# EAGLE design MCB-Pine64-IoT-Stamp-v1.0.0 (EAGLE 7.7.0)

## Sheet 1 of 2
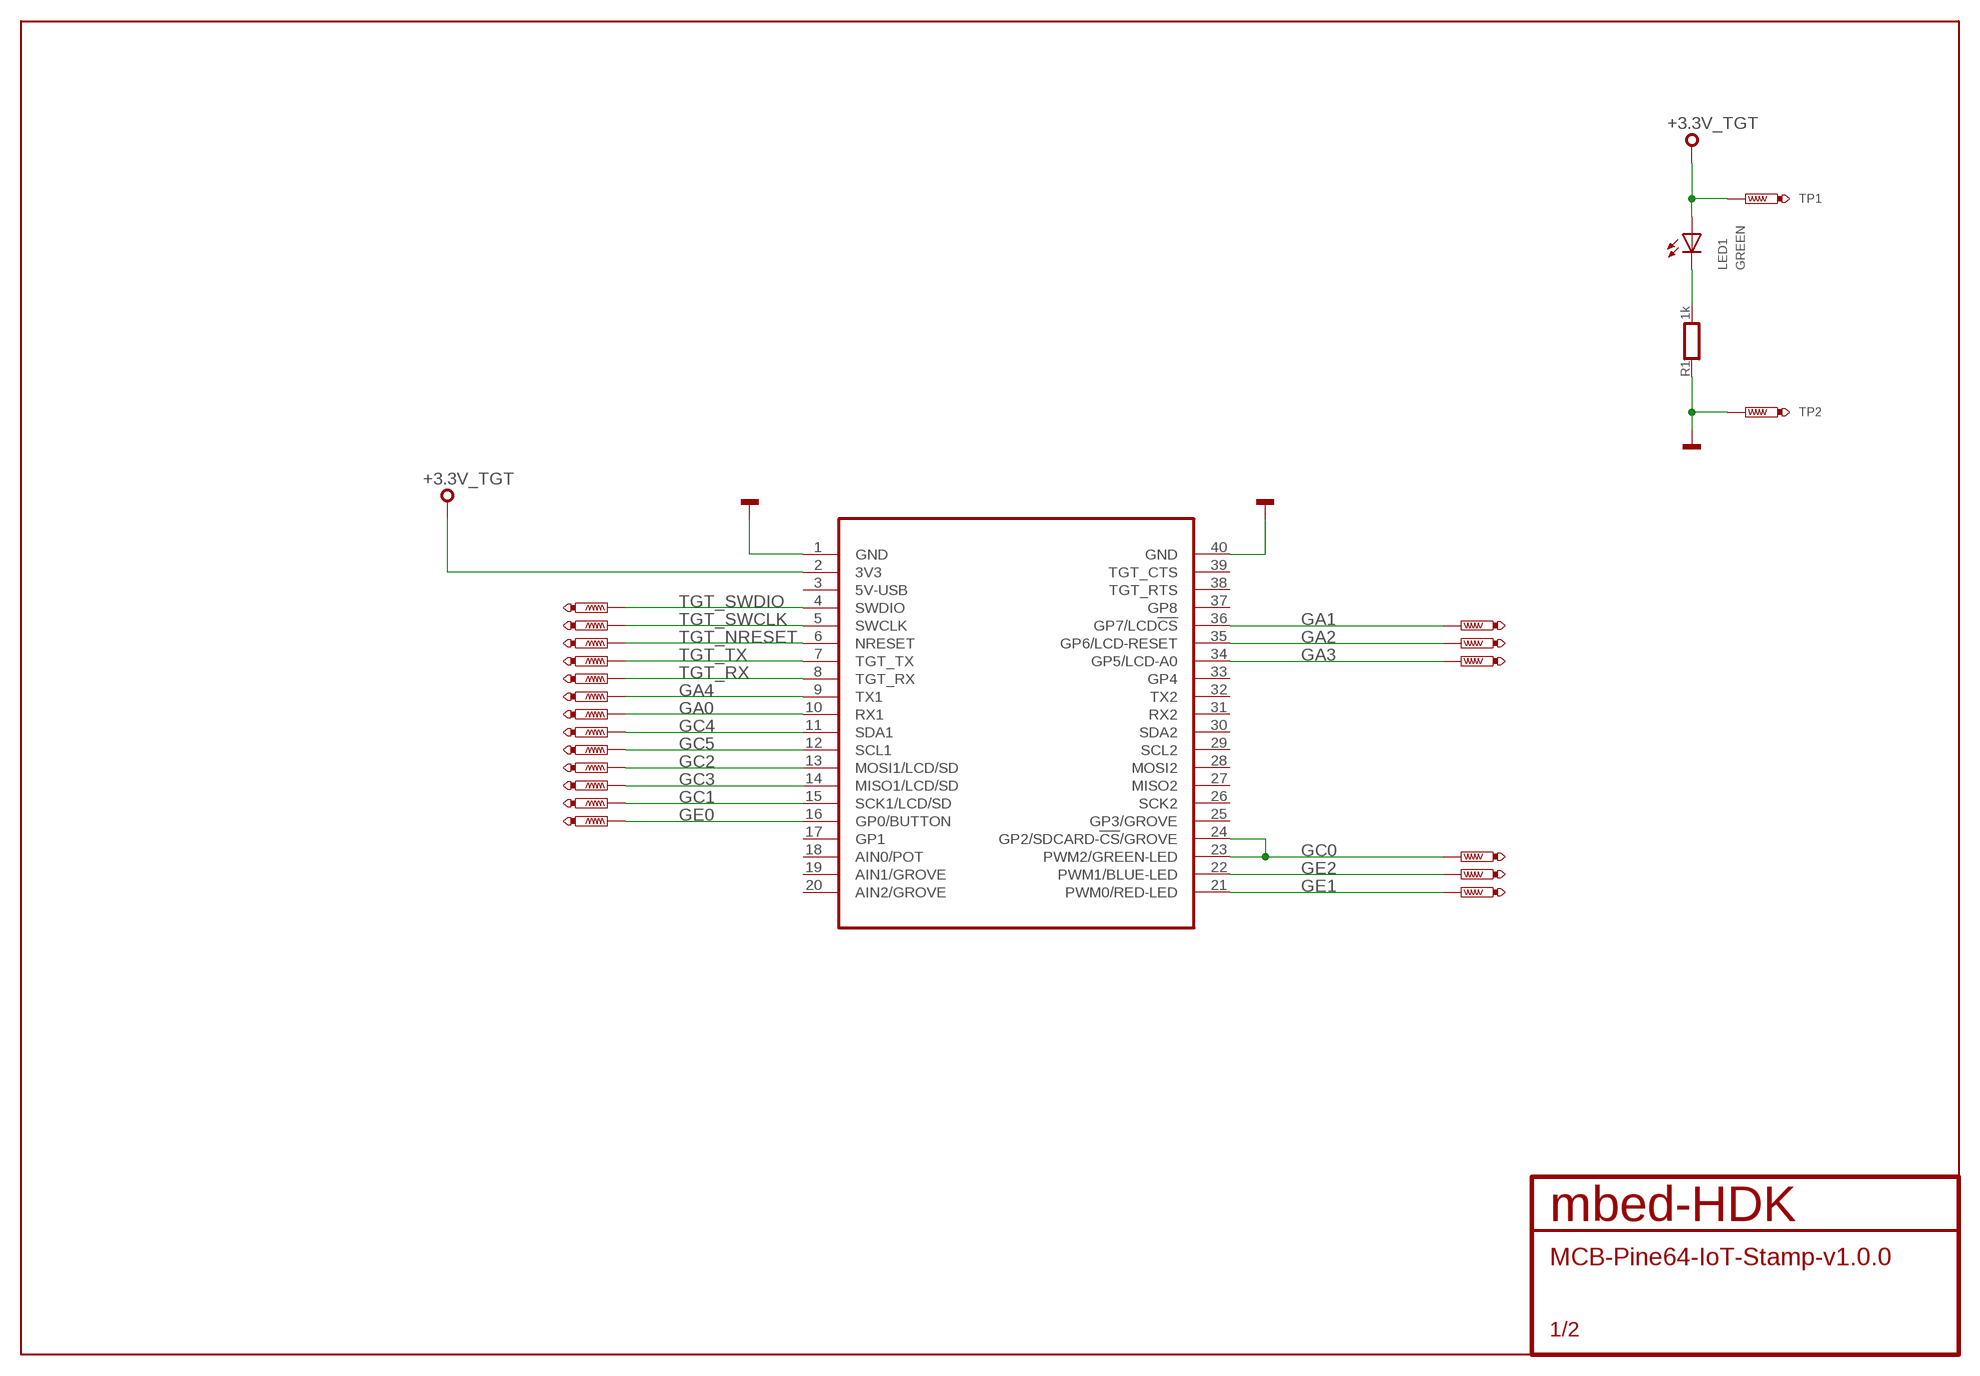
[diagram p0: schematic, sheet 1]

### Parts
LED1  GREEN  SMD_LED0603  [CHIPLED_0603]
MOD1  MODULE_DAUGHTER  [MODULE_DAUGHTER]
R1  1k  RESISTOR0603  [0603]
TP1  TEST-POINT-50R-PTH  [TP50-PTH]
TP2  TEST-POINT-50R-PTH  [TP50-PTH]
TP3  PTR1TP07R  [TP07R]
TP4  PTR1TP07R  [TP07R]
TP7  PTR1TP07R  [TP07R]
TP8  PTR1TP07R  [TP07R]
TP9  PTR1TP07R  [TP07R]
TP13  PTR1TP07R  [TP07R]
TP14  PTR1TP07R  [TP07R]
TP15  PTR1TP07R  [TP07R]
TP17  PTR1TP07R  [TP07R]
TP19  PTR1TP07R  [TP07R]
TP20  PTR1TP07R  [TP07R]
TP21  PTR1TP07R  [TP07R]
TP22  PTR1TP07R  [TP07R]
TP25  PTR1TP07R  [TP07R]
TP26  PTR1TP07R  [TP07R]
TP27  PTR1TP07R  [TP07R]
TP28  PTR1TP07R  [TP07R]
TP29  PTR1TP07R  [TP07R]
TP30  PTR1TP07R  [TP07R]

### Nets
+3.3V_TGT: LED1.A MOD1.2(3V3) TP1.TP ; also sheet 2
GA0: MOD1.10(RX1) TP21.TP ; also sheet 2
GA1: MOD1.36(GP7/LCD!CS) TP25.TP ; also sheet 2
GA2: MOD1.35(GP6/LCD-RESET) TP20.TP ; also sheet 2
GA3: MOD1.34(GP5/LCD-A0) TP19.TP ; also sheet 2
GA4: MOD1.9(TX1) TP22.TP ; also sheet 2
GC0: MOD1.23(PWM2/GREEN-LED) MOD1.24(GP2/SDCARD-!CS!/GROVE) TP15.TP ; also sheet 2
GC1: MOD1.15(SCK1/LCD/SD) TP9.TP ; also sheet 2
GC2: MOD1.13(MOSI1/LCD/SD) TP7.TP ; also sheet 2
GC3: MOD1.14(MISO1/LCD/SD) TP8.TP ; also sheet 2
GC4: MOD1.11(SDA1) TP3.TP ; also sheet 2
GC5: MOD1.12(SCL1) TP4.TP ; also sheet 2
GE0: MOD1.16(GP0/BUTTON) TP17.TP ; also sheet 2
GE1: MOD1.21(PWM0/RED-LED) TP13.TP ; also sheet 2
GE2: MOD1.22(PWM1/BLUE-LED) TP14.TP ; also sheet 2
GND: MOD1.1(GND) MOD1.40(GND) R1.1 TP2.TP ; also sheet 2
PA_1: LED1.C R1.2
TGT_NRESET: MOD1.6(NRESET) TP28.TP ; also sheet 2
TGT_RX: MOD1.8(TGT_RX) TP30.TP ; also sheet 2
TGT_SWCLK: MOD1.5(SWCLK) TP27.TP ; also sheet 2
TGT_SWDIO: MOD1.4(SWDIO) TP26.TP ; also sheet 2
TGT_TX: MOD1.7(TGT_TX) TP29.TP ; also sheet 2
Unconnected: MOD1.3(5V-USB) MOD1.17(GP1) MOD1.18(AIN0/POT) MOD1.19(AIN1/GROVE) MOD1.20(AIN2/GROVE) MOD1.25(GP3/GROVE) MOD1.26(SCK2) MOD1.27(MISO2) MOD1.28(MOSI2) MOD1.29(SCL2) MOD1.30(SDA2) MOD1.31(RX2) MOD1.32(TX2) MOD1.33(GP4) MOD1.37(GP8) MOD1.38(TGT_RTS) MOD1.39(TGT_CTS)

## Sheet 2 of 2
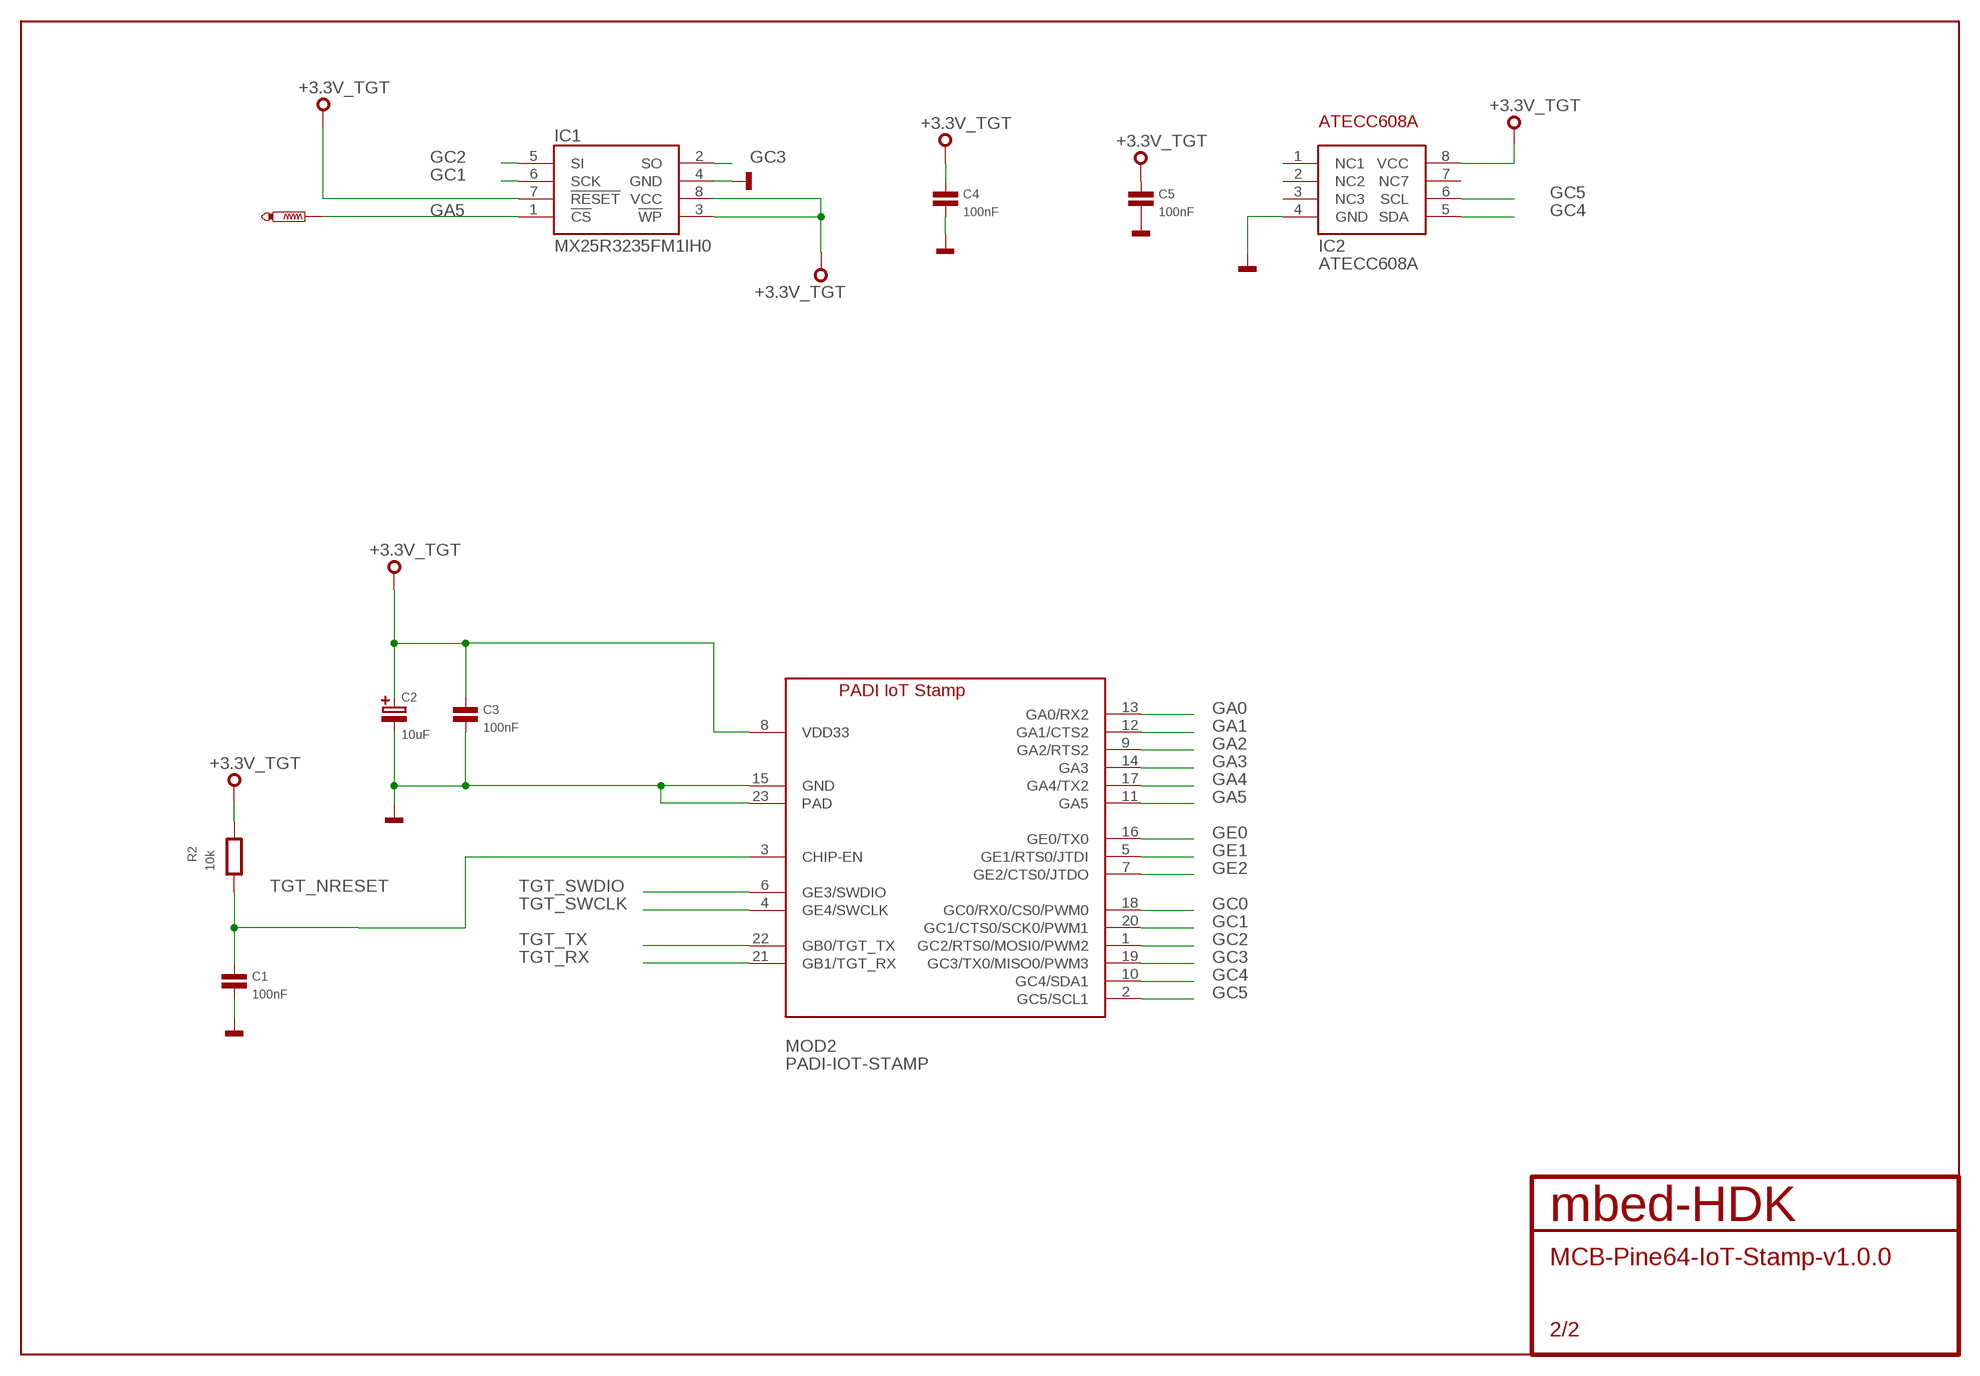
[diagram p1: schematic, sheet 2]

### Parts
C1  100nF  C0603  [0603]
C2  10uF  CAPACITOR-POLARISEDB  [SMC_B]
C3  100nF  C0603  [0603]
C4  100nF  C0603  [0603]
C5  100nF  C0603  [0603]
IC1  MX25R3235FM1IH0  [SO8]
IC2  ATECC608A  [SO8]
MOD2  PADI-IOT-STAMP  [PADI-IOT-STAMP]
R2  10k  RESISTOR0603  [0603]
TP5  PTR1TP07R  [TP07R]

### Nets
+3.3V_TGT: C2.+ C3.1 C4.1 C5.1 IC1.3(!WP) IC1.7(!RESET) IC1.8(VCC) IC2.8(VCC) MOD2.8(VDD33) R2.2 ; also sheet 1
GA0: MOD2.13(GA0/RX2) ; also sheet 1
GA1: MOD2.12(GA1/CTS2) ; also sheet 1
GA2: MOD2.9(GA2/RTS2) ; also sheet 1
GA3: MOD2.14(GA3) ; also sheet 1
GA4: MOD2.17(GA4/TX2) ; also sheet 1
GA5: IC1.1(!CS) MOD2.11(GA5) TP5.TP
GC0: MOD2.18(GC0/RX0/CS0/PWM0) ; also sheet 1
GC1: IC1.6(SCK) MOD2.20(GC1/CTS0/SCK0/PWM1) ; also sheet 1
GC2: IC1.5(SI) MOD2.1(GC2/RTS0/MOSI0/PWM2) ; also sheet 1
GC3: IC1.2(SO) MOD2.19(GC3/TX0/MISO0/PWM3) ; also sheet 1
GC4: IC2.5(SDA) MOD2.10(GC4/SDA1) ; also sheet 1
GC5: IC2.6(SCL) MOD2.2(GC5/SCL1) ; also sheet 1
GE0: MOD2.16(GE0/TX0) ; also sheet 1
GE1: MOD2.5(GE1/RTS0/JTDI) ; also sheet 1
GE2: MOD2.7(GE2/CTS0/JTDO) ; also sheet 1
GND: C1.2 C2.- C3.2 C4.2 C5.2 IC1.4(GND) IC2.4(GND) MOD2.15(GND) MOD2.23(PAD) ; also sheet 1
TGT_NRESET: C1.1 MOD2.3(CHIP-EN) R2.1 ; also sheet 1
TGT_RX: MOD2.21(GB1/TGT_RX) ; also sheet 1
TGT_SWCLK: MOD2.4(GE4/SWCLK) ; also sheet 1
TGT_SWDIO: MOD2.6(GE3/SWDIO) ; also sheet 1
TGT_TX: MOD2.22(GB0/TGT_TX) ; also sheet 1
Unconnected: IC2.1(NC1) IC2.2(NC2) IC2.3(NC3) IC2.7(NC7)

## Library data of the parts
C1 C3-C5 = mbed-HDK-RLC:C: Capacitor
C2 = mbed-HDK-RLC:CAPACITOR-POLARISED: Polarised capacitor; MF: Kemet; MFN: T491B106K020AT; OC-DIGIKEY: 399-8298-1-ND; OC-MOUSER: 80-T491B106K020; OC-NEWARK: 57K1740
IC1 = mbed-HDK-IC:MX25R3235FM1IH0: Serial Flash 32 Mb 80 Mhz; MF: Macronix; MFN: MX25R3235FM1IH0; OC-DIGIKEY: 1092-1175-ND
IC2 = mbed-HDK-MF-ATMEL:ATECC608A: I2C Secure element and crytpo accelerator; MF: Atmel; MFN: ATECC608A; OC-DIGIKEY: ATECC608A-SSHDA-TCT-ND; OC-MOUSER: 556-ATECC608ASSHDAB
LED1 = mbed-HDK-Optical:SMD_LED: LED SMD, Colour Red; MF: Wurth Electronics Inc; MFN: 150060RS75000; OC-DIGIKEY: 732-4978-1-ND; OC-MOUSER: 710-150060RS75000; OC-NEWARK: 2322071
MOD1 = mbed-HDK-misc-Board:MODULE_DAUGHTER
MOD2 = mbed-HDK-Modules:PADI-IOT-STAMP
R1 R2 = mbed-HDK-RLC:RESISTOR: Resistor
TP1 TP2 = mbed-HDK:TEST-POINT
TP3-TP5 TP7-TP9 TP13-TP15 TP17 TP19-TP22 TP25-TP30 = blackbriar:PTR1: TEST PIN

## Net classes
0 default: width 0.203 mm, drill 0.203 mm, clearance 0.203 mm

## Board
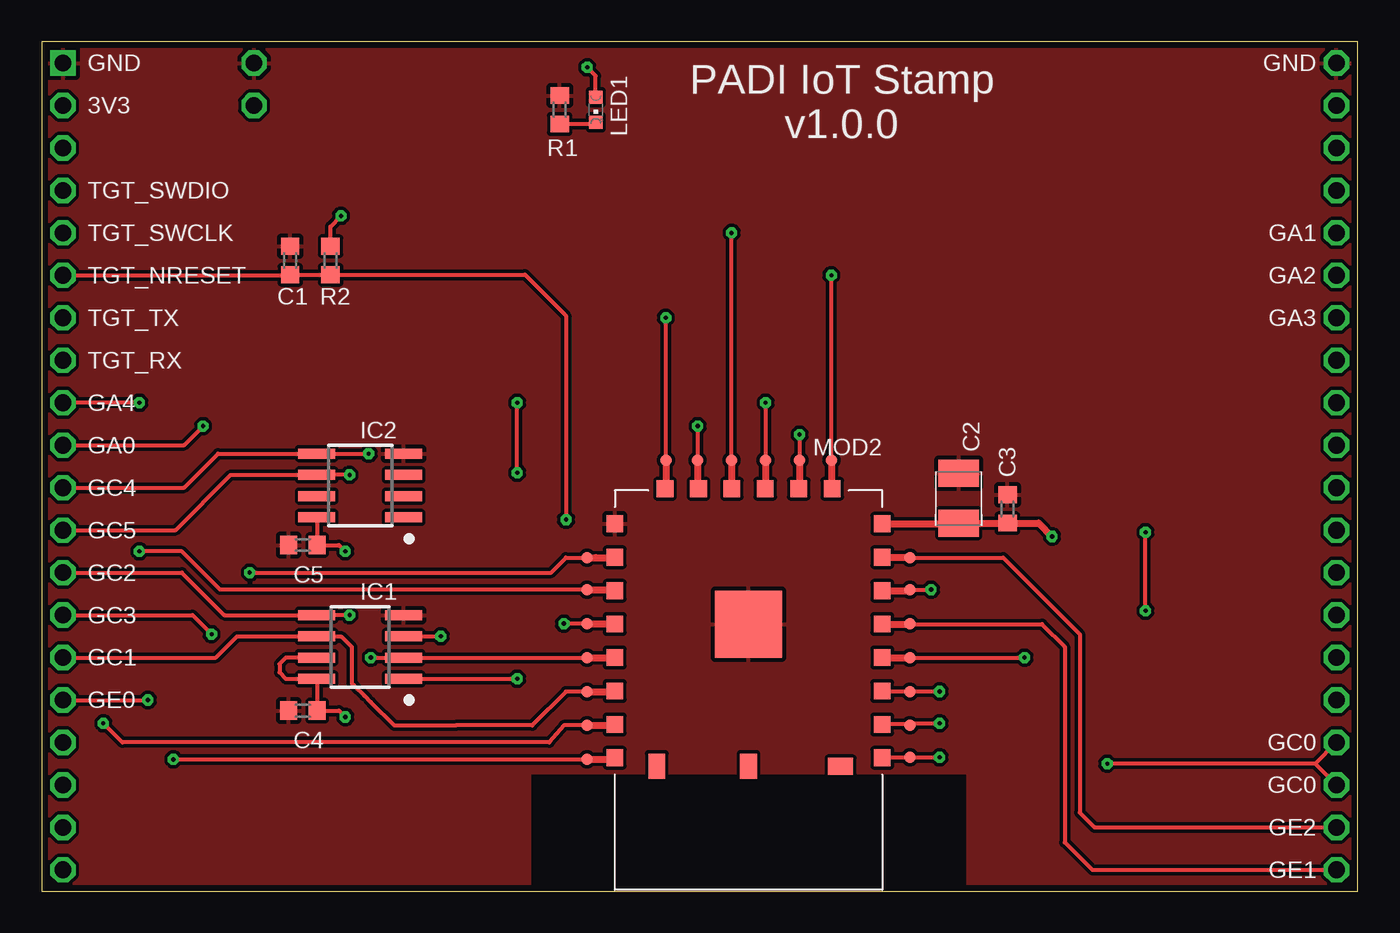
[diagram p2: board, top side]
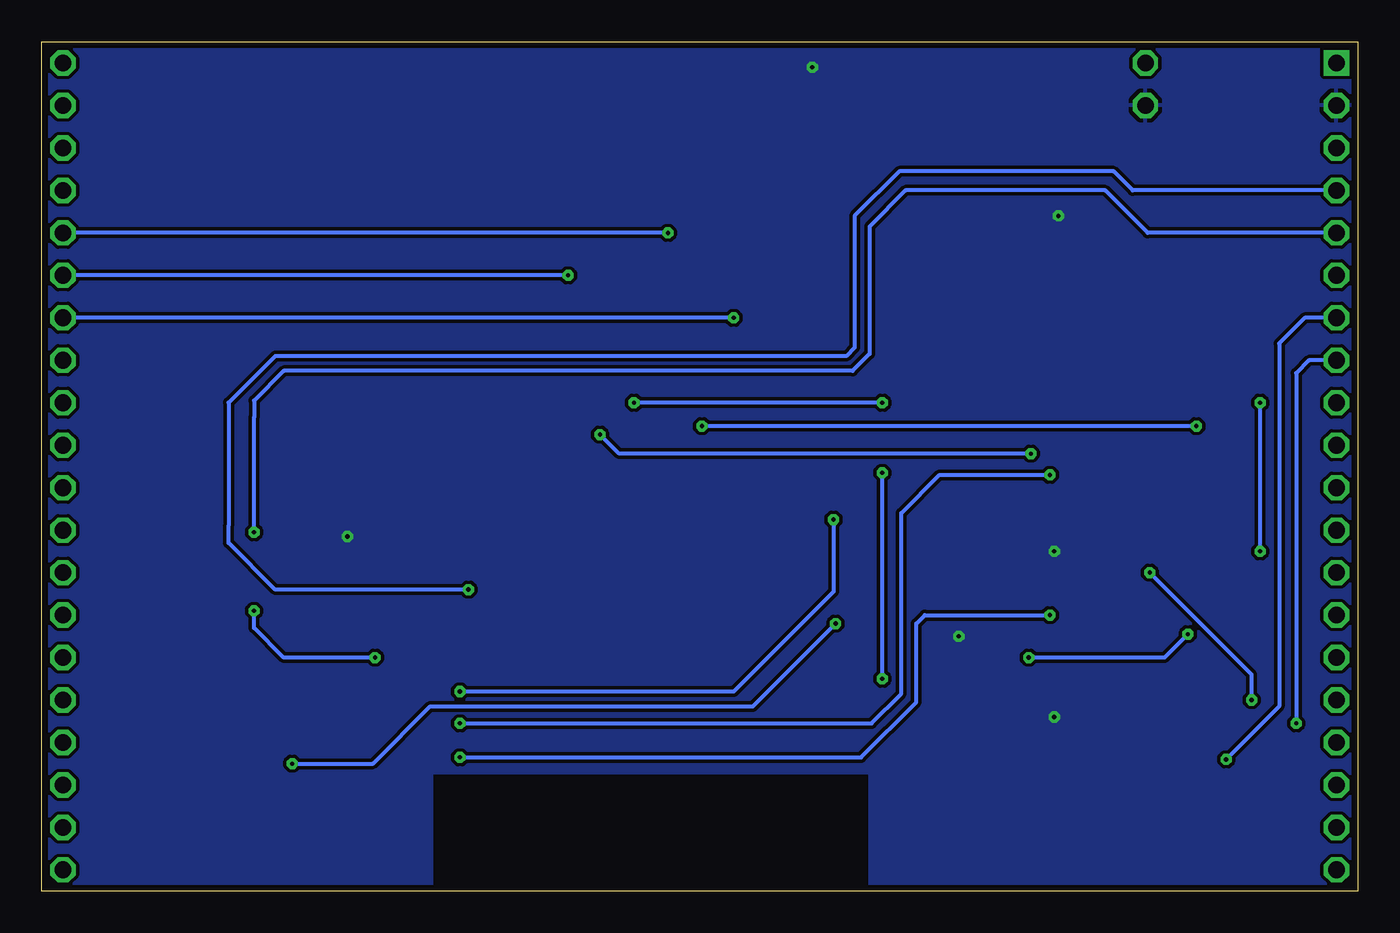
[diagram p3: board, bottom side, seen from below]

Size 78.74 x 50.8 mm. Coordinates in mm from the lower left corner, seen from the top.
Copper layers ((1*16)): Top 0.035mm / dielectric 0.8mm / Bottom 0.035mm
Design rules "mbed-HDK-8-8-2-layer": minimum track width 8mil, minimum drill 9mil, track to track 8mil, track to pad 8mil, pad to pad 8mil, via to via 8mil, smd to smd 8mil, copper to edge 15mil, drill to drill 8mil, minimum pad ring 10mil, minimum via ring 8mil, stop-mask expansion 4mil, vias tented up to drill 0mil, thermal gap 10mil

### Footprints (pad centres in the part's own frame; a part is rotated, then mirrored left to right if it is on the bottom)
0603 = smd 1 x 1.1: 1 -0.85,0; 2 0.85,0
SMC_B = smd 1.6 x 2.4: + -1.5,0; - 1.5,0
SO8 = smd 0.6 x 2.2: 1 -1.905,-2.6; 2 -0.635,-2.6; 3 0.635,-2.6; 4 1.905,-2.6; 5 1.905,2.6; 6 0.635,2.6; 7 -0.635,2.6; 8 -1.905,2.6
CHIPLED_0603 = smd 0.8 x 0.8: A 0,-0.75; C 0,0.75
MODULE_DAUGHTER = drill 1 square: 1 0,0 | drill 1 octagon: 2 0,-2.54; 3 0,-5.08; 4 0,-7.62; 5 0,-10.16; 6 0,-12.7; 7 0,-15.24; 8 0,-17.78; 9 0,-20.32; 10 0,-22.86; 11 0,-25.4; 12 0,-27.94; 13 0,-30.48; 14 0,-33.02; 15 0,-35.56; 16 0,-38.1; 17 0,-40.64; 18 0,-43.18; 19 0,-45.72; 20 0,-48.26; 21 76.2,-48.26; 22 76.2,-45.72; 23 76.2,-43.18; 24 76.2,-40.64; 25 76.2,-38.1; 26 76.2,-35.56; 27 76.2,-33.02; 28 76.2,-30.48; 29 76.2,-27.94; 30 76.2,-25.4; 31 76.2,-22.86; 32 76.2,-20.32; 33 76.2,-17.78; 34 76.2,-15.24; 35 76.2,-12.7; 36 76.2,-10.16; 37 76.2,-7.62; 38 76.2,-5.08; 39 76.2,-2.54; 40 76.2,0
PADI-IOT-STAMP = smd 1 x 1: 1 0,14; 2 0,12; 3 0,10; 4 0,8; 5 0,6; 6 0,4; 7 0,2; 8 0,0; 9 3,-2.1; 10 5,-2.1; 11 7,-2.1; 12 9,-2.1; 13 11,-2.1; 14 13,-2.1; 15 16,0; 16 16,2; 17 16,4; 18 16,6; 19 16,8; 20 16,10; 21 16,12; 22 16,14 | smd 4 x 4: 23 8,6 | smd 1.5 x 1: T1 2.5,14.5 | smd 1 x 1.5: T2 8,14.5; T3 13.5,14.5
TP50-PTH = drill 1 octagon: TP 0,0
TP07R = smd 0.7 x 0.7: TP 0,0

### Placement (x,y rotation side)
C1  14.86,37.72 90 top
C2  54.86,23.5 90 top
C3  57.79,22.86 90 top
C4  15.62,10.8 180 top
C5  15.62,20.7 180 top
IC1  19.05,14.61 90 top
IC2  19.05,24.26 90 top
LED1  33.15,46.74 180 top
MOD1  1.27,49.53 0 top
MOD2  50.29,21.97 180 top
R1  30.99,46.74 270 top
R2  17.27,37.72 90 top
SS2  FLOSSICORN0.25  [FLOSSICORN-0.25]  24.77,1.02 0 top
TP1  12.7,46.99 0 top
TP2  12.7,49.53 0 top
TP3  45.34,25.78 0 top
TP4  51.94,9.91 0 top
TP5  43.31,25.78 0 top
TP7  51.94,8 90 top
TP8  32.64,13.97 90 top
TP9  32.64,11.94 90 top
TP13  51.94,16 270 top
TP14  51.94,19.94 270 top
TP15  32.64,16 270 top
TP17  32.64,19.94 270 top
TP19  37.34,25.78 270 top
TP20  47.24,25.78 270 top
TP21  39.24,25.78 270 top
TP22  32.64,18.03 270 top
TP25  41.28,25.78 0 top
TP26  51.94,18.03 0 top
TP27  51.94,13.97 0 top
TP28  51.94,11.94 0 top
TP29  32.64,7.87 0 top
TP30  32.64,9.91 0 top

### Tracks (layer width: path | path; a pad name or v marks a point on that pad's centre or on a via)
+3.3V_TGT  (via drill 0.25)
  Top 0.254: R2.2 17.27,39.75 v17.91,40.39 | LED1.A 33.15,48.77 v32.64,49.28 | IC1.8 16.42,12.67 16.47,12.62 C4.1 17.78,10.8 v18.16,10.41 | IC1.3 v23.88,15.24 | 16.47,12.68 IC1.8 | IC1.7 14.61,13.97 14.22,13.59 14.22,13.08 14.61,12.7 IC1.8 | IC2.8 16.47,22.33 C5.1 17.78,20.7 v18.16,20.32
  Top 0.406: MOD2.8 54.86,21.97 C2.+ 57.77,22 C3.1 59.65,22.01 v60.45,21.21
  pour Bottom: 0,0 78.74,0 78.74,50.8 0,50.8
GA0  (via drill 0.25)
  Top 0.254: MOD1.10 8.51,26.67 v9.65,27.81 | v39.24,27.81 TP21.TP
  Top 0.406: TP21.TP 39.24,24.12 MOD2.13
  Bottom 0.254: v9.65,27.81 v39.24,27.81
GA1  (via drill 0.25)
  Top 0.254: TP25.TP v41.28,39.37
  Top 0.406: TP25.TP 41.28,24.09 MOD2.12
  Bottom 0.254: v41.28,39.37 MOD1.36
GA2  (via drill 0.25)
  Top 0.254: TP20.TP v47.24,36.83
  Top 0.406: TP20.TP 47.24,24.12 MOD2.9
  Bottom 0.254: v47.24,36.83 MOD1.35
GA3  (via drill 0.25)
  Top 0.254: TP19.TP v37.34,34.29
  Top 0.406: TP19.TP 37.34,24.12 MOD2.14
  Bottom 0.254: v37.34,34.29 MOD1.34
GA4  (via drill 0.25)
  Top 0.254: TP22.TP 10.67,18.03 8.38,20.32 v5.84,20.32 | v5.84,29.21 MOD1.9
  Top 0.406: TP22.TP 34.23,18.03 MOD2.17
  Bottom 0.254: v5.84,20.32 v5.84,29.21
GA5  (via drill 0.25)
  Top 0.254: IC1.1 v28.45,12.7 | v28.45,25.02 v28.45,29.21 | v43.31,29.21 TP5.TP
  Top 0.406: TP5.TP 43.31,24.09 MOD2.11
  Bottom 0.254: v28.45,12.7 v28.45,25.02 | v28.45,29.21 v43.31,29.21
GC0  (via drill 0.25)
  Top 0.254: MOD1.23 76.2,7.62 | 76.2,7.62 MOD1.24 | 76.2,7.62 v63.75,7.62 | TP15.TP v31.24,16
  Top 0.406: TP15.TP 34.26,16 MOD2.18
  Bottom 0.254: v63.75,7.62 58.93,7.62 55.5,11.05 36.2,11.05 v31.24,16
GC1
  Top 0.254: MOD1.15 10.41,13.97 11.68,15.24 IC1.6 17.91,15.24 18.54,14.61 18.54,12.45 18.67,12.32 19.3,11.68 19.68,11.3 21.08,9.91 24.77,9.91 29.34,9.91 31.37,11.94 TP9.TP
  Top 0.406: TP9.TP 34.26,11.94 MOD2.20
GC2  (via drill 0.25)
  Top 0.254: MOD1.13 8.38,19.05 10.92,16.51 IC1.5 v18.41,16.51 | 51.94,7.97 51.97,8 v53.72,8 | TP7.TP 51.91,7.97 MOD2.1
  Top 0.406: 51.94,7.97 TP7.TP
  Bottom 0.254: v53.72,8 29.72,8 26.42,11.3 26.42,16 25.91,16.51 v18.41,16.51
GC3  (via drill 0.25)
  Top 0.254: MOD1.14 9.02,16.51 v10.16,15.37 | v19.68,13.97 IC1.2 TP8.TP
  Top 0.406: TP8.TP MOD2.19
  Bottom 0.254: v10.16,15.37 11.56,13.97 12.95,13.97 v19.68,13.97
GC4  (via drill 0.25)
  Top 0.254: MOD1.11 8.51,24.13 10.54,26.16 IC2.5 v19.56,26.16 | v45.34,27.3 TP3.TP
  Top 0.406: TP3.TP 45.34,24.12 MOD2.10
  Bottom 0.254: v19.56,26.16 44.2,26.16 v45.34,27.3
GC5  (via drill 0.25)
  Top 0.254: MOD1.12 8,21.59 11.3,24.89 IC2.6 v18.41,24.89 | 51.94,9.97 52.01,10.03 v53.72,10.03 | TP4.TP 51.88,9.97 MOD2.2
  Top 0.406: 51.94,9.97 TP4.TP
  Bottom 0.254: v53.72,10.03 29.08,10.03 27.3,11.81 27.3,22.61 25.02,24.89 v18.41,24.89
GE0  (via drill 0.25)
  Top 0.254: MOD1.16 v6.35,11.43 | v12.45,19.05 30.48,19.05 31.37,19.94 33.15,19.94
  Top 0.406: TP17.TP 33.15,19.94 34.26,19.94 MOD2.16
  Bottom 0.254: v6.35,11.43 6.35,12.95 v12.45,19.05
GE1
  Top 0.254: 51.94,15.97 59.85,15.97 61.21,14.61 61.21,2.92 62.87,1.27 MOD1.21
  Top 0.406: MOD2.5 51.94,15.97 TP13.TP
GE2
  Top 0.254: TP14.TP 57.53,19.94 62.1,15.37 62.1,4.7 62.99,3.81 MOD1.22
  Top 0.406: MOD2.7 51.94,19.97 TP14.TP
GND
  pour Top: 0,0 78.74,0 78.74,50.8 0,50.8
PA_1
  Top 0.254: R1.2 33.05,45.89 LED1.C
TGT_NRESET  (via drill 0.25)
  Top 0.254: MOD1.6 14.82,36.83 C1.1 R2.1 28.92,36.87 31.37,34.42 v31.37,22.23 | v53.72,11.94 TP28.TP 50.33,11.94 MOD2.3
  Bottom 0.254: v31.37,22.23 31.37,17.91 37.34,11.94 v53.72,11.94
TGT_RX  (via drill 0.25)
  Top 0.254: TP30.TP 31.24,9.91 30.35,8.89 4.83,8.89 v3.68,10.03
  Top 0.406: TP30.TP 34.23,9.91 MOD2.21
  Bottom 0.254: MOD1.8 2.92,31.75 3.68,30.99 v3.68,10.03 3.68,9.91
TGT_SWCLK  (via drill 0.25)
  Top 0.254: TP27.TP v58.8,13.97 | v66.04,16.76 v66.04,21.46
  Top 0.406: MOD2.4 TP27.TP
  Bottom 0.254: MOD1.5 12.57,39.37 15.11,41.91 27.05,41.91 29.21,39.75 29.21,32.13 30.23,31.12 64.26,31.12 66.04,29.34 66.04,28.32 v66.04,21.46 | v58.8,13.97 64.26,13.97 66.04,15.75 v66.04,16.76
TGT_SWDIO  (via drill 0.25)
  Top 0.254: 51.94,17.97 52.01,18.03 v53.21,18.03
  Top 0.406: MOD2.6 51.94,17.97 TP26.TP
  Bottom 0.254: MOD1.4 13.46,41.91 14.61,43.05 27.43,43.05 30.1,40.39 30.1,32.51 30.61,32 64.77,32 67.56,29.21 67.56,21.84 67.56,20.83 64.77,18.03 v53.21,18.03
TGT_TX  (via drill 0.25)
  Top 0.254: v7.87,7.87 TP29.TP
  Top 0.406: TP29.TP 34.2,7.87 MOD2.22
  Bottom 0.254: MOD1.7 3.17,34.29 4.7,32.77 4.7,11.05 v7.87,7.87

### Text on the board
tPlace: GND / 3V3 / / TGT_SWDIO / TGT_SWCLK / TGT_NRESET / TGT_TX / TGT_RX / GA4 / GA0 / GC4 / GC5 / GC2 / GC3 / GC1 / GE0 | GND / / / / GA1 / GA2 / GA3 / / / / / / / / / / GC0 / GC0 / GE2 / GE1 | PADI IoT Stamp / v1.0.0